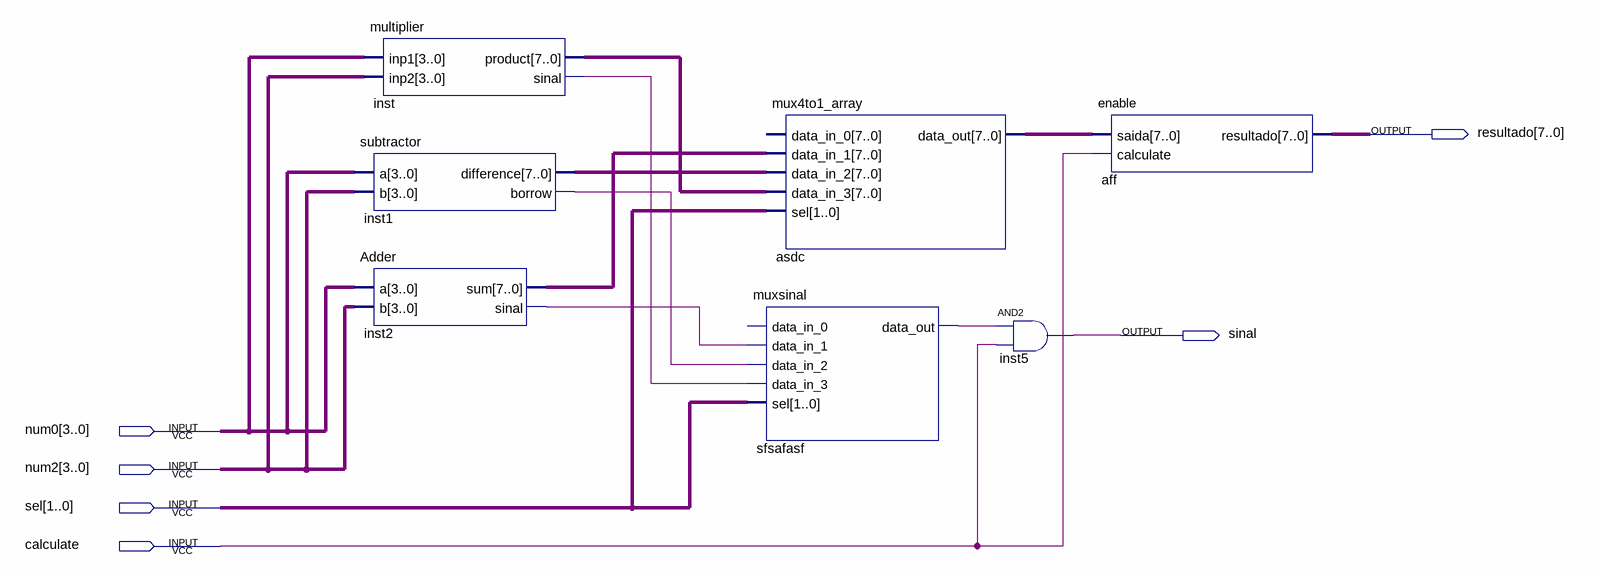
[diagram p0: schematic sheet]
// Quartus schematic ULA.bdf as structural Verilog: 7 symbols, 6 pins
module ULA (
  input  [3:0] num0,
  input  [3:0] num2,
  input  [1:0] sel,
  input  calculate,
  output [7:0] resultado,
  output sinal
);

  wire inst1_borrow, inst2_sinal, inst_sinal, sfsafasf_data_out;
  wire [7:0] asdc_data_out, inst1_difference, inst2_sum, inst_product;

  multiplier inst (.inp1(num0), .inp2(num2), .product(inst_product), .sinal(inst_sinal));
  subtractor inst1 (.a(num0), .b(num2), .difference(inst1_difference), .borrow(inst1_borrow));
  Adder inst2 (.a(num0), .b(num2), .sum(inst2_sum), .sinal(inst2_sinal));
  mux4to1_array asdc (
    .data_in_1(inst2_sum), .data_in_2(inst1_difference), .data_in_3(inst_product), .sel(sel),
    .data_out(asdc_data_out));  // open: data_in_0
  muxsinal sfsafasf (
    .data_in_1(inst2_sinal), .data_in_2(inst1_borrow), .data_in_3(inst_sinal), .sel(sel),
    .data_out(sfsafasf_data_out));  // open: data_in_0
  and inst5 (sinal, sfsafasf_data_out, calculate);
  enable aff (.saida(asdc_data_out), .calculate(calculate), .resultado(resultado));
endmodule
